# EasyEDA Pro project SoPi.epro, board PCB2
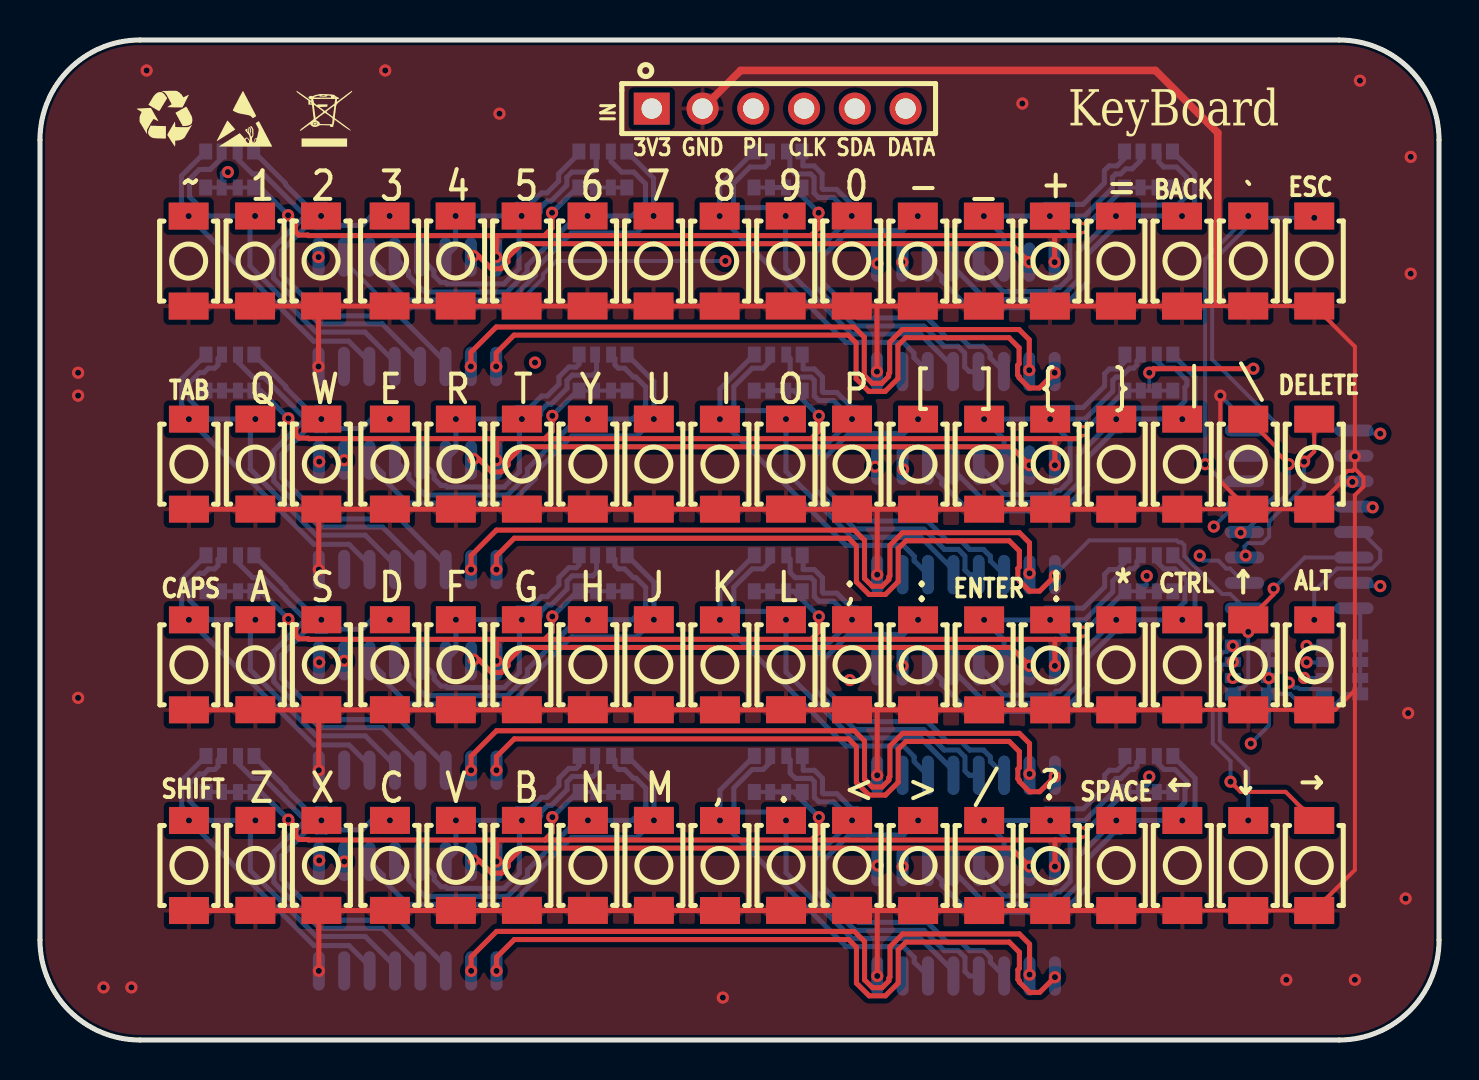
[diagram p4: board, top side]
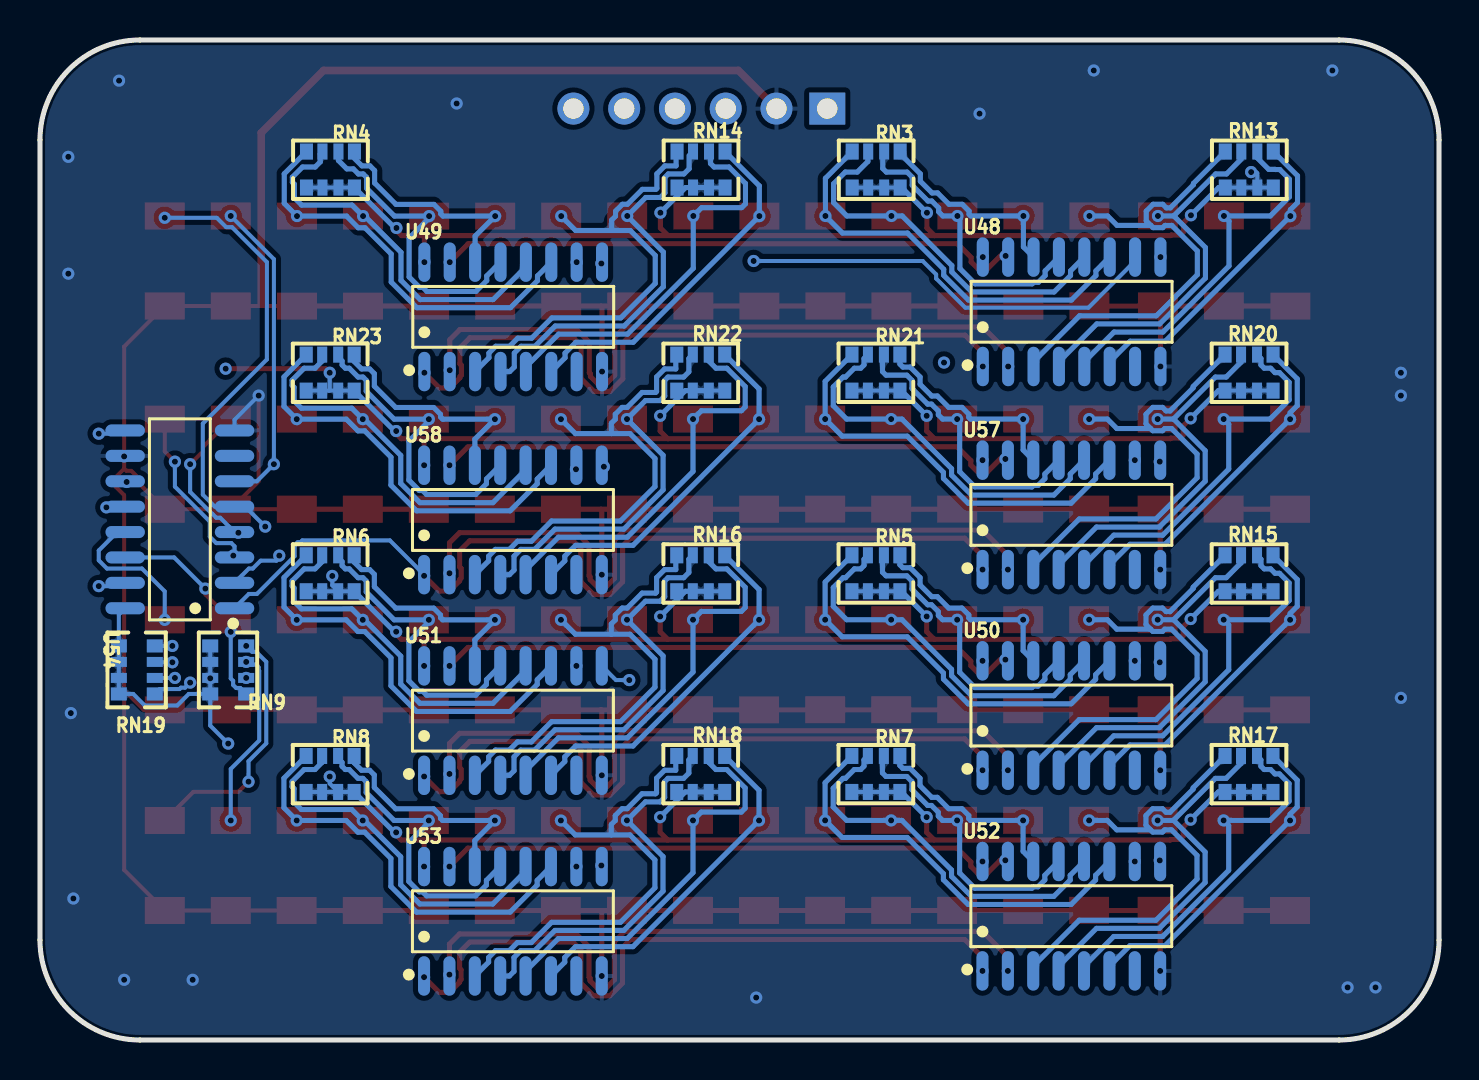
[diagram p5: board, bottom side, seen from below]

Outline 70 x 50 mm; copper layers: Top Layer, Inner1, Inner2, Bottom Layer. Coordinates in mm from the lower left corner of the outline.
Outline path: 0,45 0,5 arc(1.46,1.46) 5,0 65,0 arc(68.54,1.46) 70,5 70,45 arc(68.54,48.54) 65,50 5,50 arc(1.46,48.54) 0,45
Stack: Top Layer 0.035mm / Dielectric1 1.51mm FR4 er 4.5 / Inner1 0.035mm / Dielectric2 0.48mm PP er 4.5 / Inner2 0.035mm / Dielectric3 0.48mm PP er 4.5 / Bottom Layer 0.035mm

## Design rules (mm)
template: JLCPCB Capability(Two Layers Board)
spacing copperThickness1oz (default): track to track 0.102, other pairs 0.152 to 0.3
spacing copperThickness2oz: track to track 0.203, other pairs 0.152 to 0.3
track width copperThickness1oz (default): min 0.127, default 0.254, max 2.54
track width copperThickness2oz: min 0.203, default 0.254, max 2.54
differential pair differentialPair (default): width min 0.127, default 0.254, max 2.54; gap min 0.152, default 0.152
via viaSize (default): diameter min 0.5, default 0.61, max 10; hole min 0.3, default 0.305, max 6.3

## Placement (name value [footprint] x y rotation side)
IN  -  [HDR-TH_6P-P2.54-V-F]  36.96 46.57 0 top
RN3  10kΩ  [RES-ARRAY-SMD_0603-8P-L3.2-W1.6-BL]  28.16 43.52 0 bottom
RN4  10kΩ  [RES-ARRAY-SMD_0603-8P-L3.2-W1.6-BL]  55.47 43.52 0 bottom
RN5  10kΩ  [RES-ARRAY-SMD_0603-8P-L3.2-W1.6-BL]  28.17 23.34 0 bottom
RN6  10kΩ  [RES-ARRAY-SMD_0603-8P-L3.2-W1.6-BL]  55.48 23.34 0 bottom
RN7  10kΩ  [RES-ARRAY-SMD_0603-8P-L3.2-W1.6-BL]  28.18 13.3 0 bottom
RN8  10kΩ  [RES-ARRAY-SMD_0603-8P-L3.2-W1.6-BL]  55.48 13.3 0 bottom
RN9  10kΩ  [RES-ARRAY-SMD_0603-8P-L3.2-W1.6-BL]  60.58 18.5 90 bottom
RN13  10kΩ  [RES-ARRAY-SMD_0603-8P-L3.2-W1.6-BL]  9.49 43.52 0 bottom
RN14  10kΩ  [RES-ARRAY-SMD_0603-8P-L3.2-W1.6-BL]  36.92 43.52 0 bottom
RN15  10kΩ  [RES-ARRAY-SMD_0603-8P-L3.2-W1.6-BL]  9.51 23.34 0 bottom
RN16  10kΩ  [RES-ARRAY-SMD_0603-8P-L3.2-W1.6-BL]  36.94 23.34 0 bottom
RN17  10kΩ  [RES-ARRAY-SMD_0603-8P-L3.2-W1.6-BL]  9.51 13.3 0 bottom
RN18  10kΩ  [RES-ARRAY-SMD_0603-8P-L3.2-W1.6-BL]  36.94 13.3 0 bottom
RN19  10kΩ  [RES-ARRAY-SMD_0603-8P-L3.2-W1.6-BL]  65.15 18.5 90 bottom
RN20  10kΩ  [RES-ARRAY-SMD_0603-8P-L3.2-W1.6-BL]  9.51 33.37 0 bottom
RN21  10kΩ  [RES-ARRAY-SMD_0603-8P-L3.2-W1.6-BL]  28.17 33.37 0 bottom
RN22  10kΩ  [RES-ARRAY-SMD_0603-8P-L3.2-W1.6-BL]  36.94 33.37 0 bottom
RN23  10kΩ  [RES-ARRAY-SMD_0603-8P-L3.2-W1.6-BL]  55.48 33.37 0 bottom
SW90  -  [SW-SMD_L3.9-W2.9-P4.15-LS5.0]  7.44 38.95 90 top
SW91  -  [SW-SMD_L3.9-W2.9-P4.15-LS5.0]  10.76 38.95 90 top
SW92  -  [SW-SMD_L3.9-W2.9-P4.15-LS5.0]  14.06 38.95 90 top
SW93  -  [SW-SMD_L3.9-W2.9-P4.15-LS5.0]  17.49 38.95 90 top
SW94  -  [SW-SMD_L3.9-W2.9-P4.15-LS5.0]  20.8 38.95 90 top
SW95  -  [SW-SMD_L3.9-W2.9-P4.15-LS5.0]  24.1 38.95 90 top
SW96  -  [SW-SMD_L3.9-W2.9-P4.15-LS5.0]  27.4 38.95 90 top
SW97  -  [SW-SMD_L3.9-W2.9-P4.15-LS5.0]  30.7 38.95 90 top
SW98  -  [SW-SMD_L3.9-W2.9-P4.15-LS5.0]  34.01 38.95 90 top
SW99  -  [SW-SMD_L3.9-W2.9-P4.15-LS5.0]  37.31 38.95 90 top
SW100  -  [SW-SMD_L3.9-W2.9-P4.15-LS5.0]  40.62 38.95 90 top
SW101  -  [SW-SMD_L3.9-W2.9-P4.15-LS5.0]  43.92 38.95 90 top
SW102  -  [SW-SMD_L3.9-W2.9-P4.15-LS5.0]  47.23 38.95 90 top
SW103  -  [SW-SMD_L3.9-W2.9-P4.15-LS5.0]  50.53 38.95 90 top
SW104  -  [SW-SMD_L3.9-W2.9-P4.15-LS5.0]  53.83 38.95 90 top
SW105  -  [SW-SMD_L3.9-W2.9-P4.15-LS5.0]  57.14 38.95 90 top
SW106  -  [SW-SMD_L3.9-W2.9-P4.15-LS5.0]  7.45 18.76 90 top
SW107  -  [SW-SMD_L3.9-W2.9-P4.15-LS5.0]  10.78 18.76 90 top
SW108  -  [SW-SMD_L3.9-W2.9-P4.15-LS5.0]  14.08 18.76 90 top
SW109  -  [SW-SMD_L3.9-W2.9-P4.15-LS5.0]  17.51 18.76 90 top
SW110  -  [SW-SMD_L3.9-W2.9-P4.15-LS5.0]  20.81 18.76 90 top
SW111  -  [SW-SMD_L3.9-W2.9-P4.15-LS5.0]  24.11 18.76 90 top
SW112  -  [SW-SMD_L3.9-W2.9-P4.15-LS5.0]  27.41 18.76 90 top
SW113  -  [SW-SMD_L3.9-W2.9-P4.15-LS5.0]  30.71 18.76 90 top
SW114  -  [SW-SMD_L3.9-W2.9-P4.15-LS5.0]  34.02 18.76 90 top
SW115  -  [SW-SMD_L3.9-W2.9-P4.15-LS5.0]  37.33 18.76 90 top
SW116  -  [SW-SMD_L3.9-W2.9-P4.15-LS5.0]  40.63 18.76 90 top
SW117  -  [SW-SMD_L3.9-W2.9-P4.15-LS5.0]  43.93 18.76 90 top
SW118  -  [SW-SMD_L3.9-W2.9-P4.15-LS5.0]  47.24 18.76 90 top
SW119  -  [SW-SMD_L3.9-W2.9-P4.15-LS5.0]  50.54 18.76 90 top
SW120  -  [SW-SMD_L3.9-W2.9-P4.15-LS5.0]  53.85 18.76 90 top
SW121  -  [SW-SMD_L3.9-W2.9-P4.15-LS5.0]  57.15 18.76 90 top
SW122  -  [SW-SMD_L3.9-W2.9-P4.15-LS5.0]  7.45 8.73 90 top
SW123  -  [SW-SMD_L3.9-W2.9-P4.15-LS5.0]  10.78 8.73 90 top
SW124  -  [SW-SMD_L3.9-W2.9-P4.15-LS5.0]  14.08 8.73 90 top
SW125  -  [SW-SMD_L3.9-W2.9-P4.15-LS5.0]  17.51 8.73 90 top
SW126  -  [SW-SMD_L3.9-W2.9-P4.15-LS5.0]  20.81 8.73 90 top
SW127  -  [SW-SMD_L3.9-W2.9-P4.15-LS5.0]  24.11 8.73 90 top
SW128  -  [SW-SMD_L3.9-W2.9-P4.15-LS5.0]  27.42 8.73 90 top
SW129  -  [SW-SMD_L3.9-W2.9-P4.15-LS5.0]  30.72 8.73 90 top
SW130  -  [SW-SMD_L3.9-W2.9-P4.15-LS5.0]  34.02 8.73 90 top
SW131  -  [SW-SMD_L3.9-W2.9-P4.15-LS5.0]  37.33 8.73 90 top
SW132  -  [SW-SMD_L3.9-W2.9-P4.15-LS5.0]  40.63 8.73 90 top
SW133  -  [SW-SMD_L3.9-W2.9-P4.15-LS5.0]  43.94 8.73 90 top
SW134  -  [SW-SMD_L3.9-W2.9-P4.15-LS5.0]  47.24 8.73 90 top
SW135  -  [SW-SMD_L3.9-W2.9-P4.15-LS5.0]  50.55 8.73 90 top
SW136  -  [SW-SMD_L3.9-W2.9-P4.15-LS5.0]  53.85 8.73 90 top
SW137  -  [SW-SMD_L3.9-W2.9-P4.15-LS5.0]  57.16 8.73 90 top
SW138  -  [SW-SMD_L3.9-W2.9-P4.15-LS5.0]  60.45 38.95 90 top
SW139  -  [SW-SMD_L3.9-W2.9-P4.15-LS5.0]  63.76 38.95 90 top
SW140  -  [SW-SMD_L3.9-W2.9-P4.15-LS5.0]  60.45 28.79 90 top
SW141  -  [SW-SMD_L3.9-W2.9-P4.15-LS5.0]  63.76 28.79 90 top
SW142  -  [SW-SMD_L3.9-W2.9-P4.15-LS5.0]  60.45 18.76 90 top
SW143  -  [SW-SMD_L3.9-W2.9-P4.15-LS5.0]  63.76 18.76 90 top
SW144  -  [SW-SMD_L3.9-W2.9-P4.15-LS5.0]  60.45 8.73 90 top
SW145  -  [SW-SMD_L3.9-W2.9-P4.15-LS5.0]  63.76 8.73 90 top
SW146  -  [SW-SMD_L3.9-W2.9-P4.15-LS5.0]  7.45 28.79 90 top
SW147  -  [SW-SMD_L3.9-W2.9-P4.15-LS5.0]  10.78 28.8 90 top
SW148  -  [SW-SMD_L3.9-W2.9-P4.15-LS5.0]  14.08 28.8 90 top
SW149  -  [SW-SMD_L3.9-W2.9-P4.15-LS5.0]  17.51 28.8 90 top
SW150  -  [SW-SMD_L3.9-W2.9-P4.15-LS5.0]  20.81 28.8 90 top
SW151  -  [SW-SMD_L3.9-W2.9-P4.15-LS5.0]  24.11 28.8 90 top
SW152  -  [SW-SMD_L3.9-W2.9-P4.15-LS5.0]  27.41 28.8 90 top
SW153  -  [SW-SMD_L3.9-W2.9-P4.15-LS5.0]  30.71 28.8 90 top
SW154  -  [SW-SMD_L3.9-W2.9-P4.15-LS5.0]  34.02 28.79 90 top
SW155  -  [SW-SMD_L3.9-W2.9-P4.15-LS5.0]  37.33 28.8 90 top
SW156  -  [SW-SMD_L3.9-W2.9-P4.15-LS5.0]  40.63 28.8 90 top
SW157  -  [SW-SMD_L3.9-W2.9-P4.15-LS5.0]  43.93 28.79 90 top
SW158  -  [SW-SMD_L3.9-W2.9-P4.15-LS5.0]  47.24 28.79 90 top
SW159  -  [SW-SMD_L3.9-W2.9-P4.15-LS5.0]  50.54 28.79 90 top
SW160  -  [SW-SMD_L3.9-W2.9-P4.15-LS5.0]  53.85 28.79 90 top
SW161  -  [SW-SMD_L3.9-W2.9-P4.15-LS5.0]  57.15 28.79 90 top
U48  -  [SOIC-16_L9.9-W3.9-P1.27-LS6.0-BL]  18.38 36.41 180 bottom
U49  -  [SOIC-16_L9.9-W3.9-P1.27-LS6.0-BL]  46.32 36.16 180 bottom
U50  -  [SOIC-16_L9.9-W3.9-P1.27-LS6.0-BL]  18.4 16.22 180 bottom
U51  -  [SOIC-16_L9.9-W3.9-P1.27-LS6.0-BL]  46.34 15.97 180 bottom
U52  -  [SOIC-16_L9.9-W3.9-P1.27-LS6.0-BL]  18.4 6.19 180 bottom
U53  -  [SOIC-16_L9.9-W3.9-P1.27-LS6.0-BL]  46.34 5.94 180 bottom
U54  -  [SOIC-16_L9.9-W3.9-P1.27-LS6.0-BL]  63 26.03 90 bottom
U57  -  [SOIC-16_L9.9-W3.9-P1.27-LS6.0-BL]  18.4 26.26 180 bottom
U58  -  [SOIC-16_L9.9-W3.9-P1.27-LS6.0-BL]  46.34 26 180 bottom

## Footprints (pads in the part's own frame, mm; a bottom-side part is the same pattern mirrored in y, then rotated)
HDR-TH_6P-P2.54-V-F
  rect 1.8x1.6 hole 1.02: 1(-6.35,0)
  round 1.6 hole 1.02: 2(-3.81,0) 3(-1.27,0) 4(1.27,0) 5(3.81,0) 6(6.35,0)
RES-ARRAY-SMD_0603-8P-L3.2-W1.6-BL
  rect 0.65x0.8 smd: 1(-1.2,-0.9) 4(1.2,-0.9) 5(1.2,0.9) 8(-1.2,0.9)
  rect 0.5x0.8 smd: 2(-0.4,-0.9) 3(0.4,-0.9) 6(0.4,0.9) 7(-0.4,0.9)
SOIC-16_L9.9-W3.9-P1.27-LS6.0-BL
  oval 0.602x1.971 smd: 1(-4.445,-2.736) 2(-3.175,-2.736) 3(-1.905,-2.736) 4(-0.635,-2.736) 5(0.635,-2.736) 6(1.905,-2.736) 7(3.175,-2.736) 8(4.445,-2.736) 9(4.445,2.736) 10(3.175,2.736) 11(1.905,2.736) 12(0.635,2.736) 13(-0.635,2.736) 14(-1.905,2.736) 15(-3.175,2.736) 16(-4.445,2.736)
SW-SMD_L3.9-W2.9-P4.15-LS5.0
  rect 1.351x1.999 smd: 1(-2.251,0) 2(2.251,0)

## Nets
As in the schematic.

Pads without a net: U48 7; U49 7; U50 7; U51 7; U52 7; U53 7; U54 7; U57 7; U58 7

## Via types
v1: diameter 0.61, hole 0.305, Top Layer to Bottom Layer, 188 vias

## Routing (per net, layer and track width the routed paths; a pad name or vN(x,y) marks a point on that pad's centre or on a via; arc(x,y) is an arc through that point)
+3V3: length 318.2
  Top Layer w0.254: 22.81,10 22.84,9.97 v1(22.84,8.93) ; 22.81,10 13.44,10 13.42,10.03 12.97,10.03 12.8,10.19 12.8,10.64 v1(12.43,11.02) ; 22.81,10 25.26,10 ; 50.8,40.22 50.77,40.18 v1(50.77,38.89) ; 50.8,40.22 38.58,40.22 ; 50.8,40.22 51.91,40.22 52.16,40.48 v1(52.16,40.6) ; v1(52.18,30.45) 52.18,30.32 51.92,30.07 50.82,30.07 ; 25.25,30.07 25.63,30.45 v1(25.63,31.21) ; 25.25,30.07 22.81,30.07 ; 25.25,30.07 38.59,30.07 ; 22.81,30.07 22.84,30.04 v1(22.84,28.99) ; 22.81,30.07 13.44,30.07 13.42,30.09 12.96,30.09 12.8,30.26 12.8,30.71 v1(12.43,31.08) ; 50.82,30.07 50.78,30.03 v1(50.78,28.74) ; 50.82,30.07 38.59,30.07 ; 50.82,20.03 50.78,20 v1(50.78,18.71) ; 50.82,20.03 38.59,20.03 ; 50.82,20.03 51.92,20.03 52.18,20.29 v1(52.18,20.41) ; 38.59,10 38.97,10.38 v1(38.97,11.14) ; 38.59,10 50.82,10 ; 38.59,10 25.26,10 ; 50.82,10 51.93,10 52.18,10.25 v1(52.18,10.38) ; 50.82,10 50.78,9.96 v1(50.78,8.67) ; v1(38.97,31.21) 38.97,30.45 38.59,30.07 ; 22.81,20.03 25.25,20.03 ; 22.81,20.03 22.84,20 v1(22.84,18.96) ; 22.81,20.03 13.44,20.03 13.42,20.06 12.96,20.06 12.8,20.22 12.8,20.68 v1(12.43,21.05) ; 25.25,20.03 25.63,20.41 v1(25.63,21.18) ; 25.25,20.03 38.59,20.03 ; v1(38.96,41.36) 38.96,40.6 38.58,40.22 ; 38.58,40.22 25.24,40.22 ; 25.24,40.22 25.62,40.6 v1(25.62,41.36) ; 25.24,40.22 22.8,40.22 ; v1(12.41,41.24) 12.79,40.86 12.79,40.41 12.95,40.25 13.4,40.25 13.43,40.22 22.8,40.22 ; v1(38.97,21.18) 38.97,20.41 38.59,20.03 ; 22.8,40.22 22.83,40.19 v1(22.83,39.15) ; v1(55.5,33.36) 55.7,33.56 v1(60.71,33.56) ; 25.26,10 25.64,10.38 v1(25.64,11.14)
  Inner1 w0.2: v1(9.4,43.4) 9.07,43.73 ; v1(55.5,33.36) 50.77,38.1 v1(50.77,38.89) ; v1(55.5,13.17) 58.93,13.17 v1(60.58,14.82) 58.8,16.6 58.8,20.28 55.88,23.2 v1(55.37,23.2) 50.78,27.8 v1(50.78,28.74)
  Inner1 w0.381: v1(25.62,41.36) 25.62,41.84 30.36,46.57 IN.1
  Bottom Layer w0.2: RN15.8 RN15.7 RN15.6 RN15.5 ; RN4.5 RN4.6 RN4.7 RN4.8 ; RN13.7 RN13.6 RN13.5 ; RN13.7 9.09,43.34 9.15,43.4 v1(9.4,43.4) ; RN13.7 RN13.8 ; RN20.8 RN20.7 RN20.6 RN20.5 ; RN6.5 RN6.6 RN6.7 ; RN8.8 RN8.7 ; RN8.7 55.5,12.82 v1(55.5,13.17) ; RN8.7 RN8.6 RN8.5 ; RN17.8 RN17.7 RN17.6 RN17.5 ; v1(55.5,33.36) 55.5,32.5 55.53,32.47 ; RN16.8 RN16.7 ; RN18.8 RN18.7 ; RN23.5 RN23.6 55.53,32.47 ; RN9.8 RN9.6 RN9.5 ; RN9.8 62.55,17.3 63.13,16.73 64.76,16.73 65.34,17.3 RN19.8 RN19.6 RN19.5 66.05,21.27 U54.16 ; RN9.8 61.48,15.72 v1(60.58,14.82) ; RN6.8 RN6.7 ; RN6.7 55.37,22.73 v1(55.37,23.2) ; 55.53,32.47 RN23.7 RN23.8 ; RN14.8 RN14.7 ; RN21.5 RN21.6 RN21.7 RN21.8 ; RN3.8 RN3.7 RN3.6 RN3.5 ; RN7.5 RN7.6 RN7.7 RN7.8 ; RN5.8 RN5.7 RN5.6 RN5.5 ; RN22.8 RN22.7
  Bottom Layer w0.254: v1(25.63,31.21) 26.89,32.47 RN21.8 ; RN23.8 52.26,30.45 v1(52.18,30.45) ; v1(38.97,21.18) 37.71,22.44 RN16.6 RN16.7 ; RN20.5 11.04,32.47 v1(12.43,31.08) ; v1(12.43,11.02) 11.04,12.4 RN17.5 ; RN4.8 52.25,40.6 v1(52.16,40.6) ; v1(12.41,41.24) 11.03,42.62 RN13.5 ; RN6.8 52.26,20.41 v1(52.18,20.41) ; v1(25.64,11.14) 26.9,12.4 RN7.8 ; v1(38.97,11.14) 37.71,12.4 RN18.6 RN18.7 ; RN15.5 11.04,22.44 v1(12.43,21.05) ; v1(38.96,41.36) 37.7,42.62 RN14.6 RN14.7 ; RN5.8 26.89,22.44 v1(25.63,21.18) ; v1(52.18,10.38) 52.26,10.38 RN8.8 ; RN22.7 RN22.6 37.71,32.47 v1(38.97,31.21) ; RN3.8 26.88,42.62 v1(25.62,41.36)
  vias: v1(61.48,18.09)
GND: length 333.8
  Top Layer w0.2: 65.79,28.57 65.79,28.56 66.22,28.13 66.22,27.67 65.79,27.24 65.79,17.49 ; 65.79,28.57 65.68,28.46 65.43,28.46 65.11,28.13 65.11,27.89 SW141.1 SW140.1 ; 65.79,28.57 v1(65.79,29.18) 65.79,34.67 SW139.1 63.75,36.7 SW105.1 ; 7.16,6.19 SW122.1 ; v1(59.06,32.22) 59.06,27.94 SW140.1 ; SW140.1 SW161.1 ; SW121.1 SW142.1 SW143.1 64.81,16.51 65.79,17.49 ; 65.79,17.49 65.79,8.51 SW145.1 SW144.1 SW137.1
  Top Layer w0.254: 41.93,36.7 SW98.1 14.06,36.7 ; 41.93,36.7 SW101.1 SW102.1 SW103.1 SW104.1 SW105.1 ; 41.93,36.7 41.88,36.64 v1(41.88,33.42) ; v1(41.89,3.2) 41.89,6.42 41.95,6.47 ; v1(13.95,3.45) 13.95,6.35 14.08,6.47 ; 14.06,36.7 SW92.1 ; 14.06,36.7 13.94,36.57 v1(13.94,33.68) ; 14.06,36.7 SW90.1 ; v1(13.95,23.52) 13.95,26.42 14.07,26.54 ; 41.95,26.54 SW154.1 14.07,26.54 ; 41.95,26.54 41.89,26.49 v1(41.89,23.27) ; 41.95,26.54 SW157.1 SW158.1 SW159.1 SW160.1 SW161.1 ; 14.08,6.47 SW130.1 41.95,6.47 ; 14.08,6.47 SW122.1 ; 14.08,6.47 SW124.1 ; SW137.1 SW136.1 SW135.1 SW134.1 SW133.1 41.95,6.47 ; 14.07,16.51 SW114.1 41.95,16.51 ; 14.07,16.51 SW106.1 ; 14.07,16.51 SW108.1 ; 14.07,16.51 13.95,16.39 v1(13.95,13.49) ; SW121.1 SW120.1 SW119.1 SW118.1 SW117.1 41.95,16.51 ; v1(41.89,13.23) 41.89,16.45 41.95,16.51 ; 14.07,26.54 SW148.1 ; 14.07,26.54 SW146.1
  Top Layer w0.381: IN.2 35.05,48.48 55.81,48.48 58.93,45.36 58.93,36.79
  Bottom Layer w0.2: v1(59.06,32.22) 60.27,31.01 U54.8
  vias: v1(1.91,33.36) v1(1.91,32.22) v1(1.91,17.11) v1(3.18,2.63) v1(4.58,2.63) v1(5.34,48.48) v1(17.27,48.48) v1(22.99,46.32) v1(34.17,2.12) v1(49.15,46.83) v1(62.36,3.01) v1(65.79,3.01) v1(66.04,47.97) v1(68.33,7.07) v1(68.46,16.35) v1(68.58,44.16) v1(68.58,38.32)
PE3: length 45.3
  Inner1 w0.254: v1(13.97,28.92) 16.13,31.08 16.13,43.52 20.7,48.1 41.79,48.1 IN.6
  Bottom Layer w0.2: U57.9 13.95,28.94 v1(13.97,28.92)
PE9: length 205.8
  Top Layer w0.254: v1(50.78,3.14) 50.02,2.38 49.51,2.38 49.01,2.89 49.01,2.95 48.93,3.03 48.93,3.51 49.01,3.59 49.01,4.39 48.5,4.9 43.33,4.9 42.94,4.51 42.94,2.85 42.3,2.21 41.48,2.21 40.85,2.84 40.85,4.63 40.46,5.02 23.73,5.02 22.84,4.13 v1(22.84,3.45) ; v1(22.84,13.49) 22.84,14.17 23.73,15.06 40.46,15.06 40.85,14.67 40.85,12.87 41.48,12.24 42.3,12.24 42.94,12.88 42.94,14.54 43.33,14.93 48.49,14.93 49,14.42 49,13.62 48.93,13.54 48.93,13.06 49,12.98 49,12.92 49.51,12.41 50.02,12.41 v1(50.78,13.18) ; v1(50.78,23.21) 50.02,22.45 49.51,22.45 49,22.95 49,23.02 48.93,23.09 48.93,23.58 49,23.65 49,24.45 48.49,24.96 43.33,24.96 42.94,24.57 42.94,22.92 42.3,22.28 41.48,22.28 40.85,22.91 40.85,24.7 40.46,25.09 23.73,25.09 22.84,24.2 v1(22.84,23.52) ; v1(50.77,33.36) 50.01,32.6 49.5,32.6 48.99,33.11 48.99,33.17 48.91,33.25 48.91,33.73 48.99,33.81 48.99,34.61 48.48,35.12 43.32,35.12 42.93,34.73 42.93,33.07 42.29,32.43 41.47,32.43 40.84,33.06 40.84,34.85 40.45,35.24 23.72,35.24 22.83,34.35 v1(22.83,33.68)
  Inner1 w0.2: v1(22.83,33.68) 22.83,30.22 23.37,29.68 23.37,29.25 23.4,29.22 23.4,28.76 23.37,28.73 23.37,24.05 v1(22.84,23.52) 23.75,22.61 23.75,21.44 23.55,21.24 23.55,20.78 23.75,20.58 23.75,14.4 v1(22.84,13.49) 23.5,12.83 23.5,4.11 v1(22.84,3.45)
  Inner1 w0.254: v1(22.83,33.68) 28.99,39.84 30.99,39.84 32.31,41.16 32.31,42.43 35.69,45.81 IN.3
  Bottom Layer w0.2: U58.1 52.49,24.98 56.87,24.98 56.96,24.89 57.11,24.89 57.26,24.74 57.26,24.19 59.14,22.3 59.55,22.3 U54.1
PE10: length 203.2
  Top Layer w0.254: v1(21.57,13.49) 21.57,14.19 22.84,15.46 40.75,15.46 41.26,14.95 41.26,13.04 41.65,12.65 42.13,12.65 42.47,12.99 42.47,13.12 42.53,13.18 42.53,14.7 43.16,15.33 49,15.33 49.51,14.83 v1(49.51,13.3) ; v1(21.56,33.68) 21.56,34.38 22.83,35.65 40.73,35.65 41.24,35.14 41.24,33.23 41.64,32.84 42.12,32.84 42.46,33.18 42.46,33.31 42.51,33.36 42.51,34.89 43.15,35.52 48.99,35.52 49.5,35.01 v1(49.5,33.49) ; v1(21.57,3.45) 21.57,4.16 22.84,5.43 40.75,5.43 41.26,4.92 41.26,3.01 41.65,2.62 42.14,2.62 42.48,2.96 42.48,3.09 42.53,3.14 42.53,4.67 43.16,5.3 49.01,5.3 49.51,4.79 v1(49.51,3.27) ; v1(49.51,23.34) 49.51,24.86 49,25.37 43.16,25.37 42.53,24.73 42.53,23.21 42.47,23.16 42.47,23.03 42.13,22.68 41.65,22.68 41.26,23.08 41.26,24.99 40.75,25.49 22.84,25.49 21.57,24.22 v1(21.57,23.52)
  Inner1 w0.2: v1(21.56,33.68) 22.25,32.98 22.25,28.82 22.23,28.79 ; 22.23,14.15 v1(21.57,13.49) ; 22.23,14.15 22.23,9.24 22.26,9.22 22.26,8.75 22.23,8.73 22.23,4.11 v1(21.57,3.45) ; 22.23,14.15 22.23,18.76 22.25,18.79 22.25,19.25 22.23,19.27 22.23,22.86 v1(21.57,23.52) 22.23,24.18 22.23,28.79
  Inner1 w0.254: IN.4 38.23,45.43 49.5,34.16 v1(49.5,33.49)
  Inner2 w0.2: v1(58.03,24.22) 50.39,24.22 v1(49.51,23.34)
  Bottom Layer w0.2: U54.2 59.55,23.57 59.35,23.57 58.96,23.97 58.17,23.97 58.17,24.08 v1(58.03,24.22)
  Bottom Layer w0.254: v1(49.51,23.34) U58.2 ; v1(49.51,3.27) 49.51,3.2 ; v1(49.5,33.49) U49.2 ; v1(49.51,13.3) U51.2
PE12: length 184.7
  Top Layer w0.254: v1(21.7,19.02) 21.96,19.02 22.6,18.38 23.08,18.38 23.42,18.72 23.42,18.94 24.11,19.63 48.59,19.63 v1(49.51,18.71) ; v1(21.7,29.05) 21.96,29.05 22.6,28.41 23.08,28.41 23.42,28.75 23.42,28.97 24.11,29.66 48.59,29.66 v1(49.51,28.74) ; v1(49.51,8.67) 48.59,9.59 24.11,9.59 23.43,8.91 23.43,8.68 23.08,8.34 22.6,8.34 21.96,8.98 v1(21.7,8.98) ; v1(21.68,39.21) 21.94,39.21 22.59,38.56 23.07,38.56 23.41,38.9 23.41,39.13 24.1,39.82 48.58,39.82 v1(49.5,38.89)
  Inner1 w0.2: v1(21.68,39.21) 21.68,34.59 21,33.91 21,33.44 21.68,32.76 21.68,29.06 v1(21.7,29.05) 21.7,24.44 21.01,23.75 21.01,23.29 21.34,22.96 21.63,22.96 21.7,22.9 v1(21.7,19.02) 21.7,14.4 21.01,13.72 21.01,13.26 21.7,12.57 21.7,8.99 v1(21.7,8.98)
  Inner1 w0.254: v1(49.5,38.89) 48.45,38.89 IN.5
  Inner2 w0.2: v1(49.51,18.71) 49.99,18.71 50.55,18.15 51.01,18.15 51.57,18.71 57.97,18.71 59.31,17.36 62.21,17.36 62.26,17.31 62.72,17.31 62.77,17.36 64.14,17.36 64.28,17.5 64.28,19.92 v1(67.06,22.7)
  Bottom Layer w0.2: v1(67.06,22.7) 65.9,22.7 U54.15
  Bottom Layer w0.254: U57.15 21.63,29.05 v1(21.7,29.05) ; v1(21.7,8.98) 21.63,8.98 21.57,8.93 ; U48.15 21.62,39.21 v1(21.68,39.21) ; U50.15 21.63,19.02 v1(21.7,19.02)
$1N34101: length 16.2
  Bottom Layer w0.254: RN15.1 7.09,23.02 7.09,21.68 7.45,21.33 v1(7.45,21.01) 13.71,14.75 ; 13.71,14.75 15.46,14.75 16.49,13.72 U50.6
$1N34102: length 19
  Bottom Layer w0.254: U50.5 17.76,13.72 16.27,15.21 13.83,15.21 10.52,18.51 10.52,20.76 v1(10.78,21.01) 8.46,21.01 7.5,21.97 7.5,22.85 7.98,23.34 8.21,23.34 8.43,23.56 8.75,23.56 8.91,23.72 8.91,24.04 RN15.2
$1N34103: length 18.8
  Bottom Layer w0.254: U50.4 19.03,13.72 17.14,15.62 13.99,15.62 11.7,17.91 11.7,19.43 13.28,21.01 ; 13.28,21.01 v1(14.08,21.01) ; 13.28,21.01 13.28,21.02 11.19,23.11 10.65,23.11 9.91,23.86 RN15.3
$1N34104: length 23.8
  Bottom Layer w0.254: 14.43,20.54 14.32,20.43 13.84,20.43 13.72,20.54 13.38,20.54 12.11,19.27 12.11,18.08 14.16,16.02 18,16.02 20.3,13.72 U50.3 ; 14.43,20.54 14.66,20.77 14.66,21.26 14.32,21.6 13.84,21.6 13.66,21.42 13.46,21.42 12.3,22.58 12.3,22.64 RN15.4 ; 14.43,20.54 16.12,20.54 16.59,21.01 v1(17.51,21.01)
$1N34105: length 20.9
  Bottom Layer w0.254: U50.11 17.18,18.27 17.18,18.03 18.41,16.81 23.56,16.81 24.8,18.05 24.8,18.35 26.61,20.16 29.86,20.16 v1(30.71,21.01) 30.71,22.9 RN5.4
$1N34106: length 10.4
  Bottom Layer w0.254: RN5.1 26.97,23.76 26.83,23.61 26.46,23.61 25.96,23.12 25.96,22.75 25.38,22.17 25.1,22.17 24.53,21.6 23.87,21.6 23.53,21.26 23.53,21.1 23.44,21.01 v1(20.81,21.01) 20.81,19.47 U50.14
$1N34107: length 14.6
  Bottom Layer w0.254: RN5.2 27.85,24.16 27.85,23.39 27.67,23.21 26.63,23.21 26.37,22.95 26.37,22.55 25.58,21.76 25.39,21.76 25.05,21.42 25.05,21.23 24.84,21.01 v1(24.11,21.01) 23.98,20.89 23.98,18.38 23.22,17.62 20.37,17.62 20.3,17.69 20.06,17.69 19.72,18.03 19.72,18.27 U50.13
$1N34108: length 19
  Bottom Layer w0.254: RN5.3 28.77,24.04 28.77,23.72 28.93,23.56 29.25,23.56 29.7,23.11 29.81,23.11 30.31,22.62 30.31,21.68 29.64,21.01 v1(27.41,21.01) 26.87,21.01 24.39,18.53 24.39,18.21 23.39,17.21 19.27,17.21 18.45,18.03 18.45,18.27 U50.12
$1N34113: length 17.7
  Bottom Layer w0.254: U53.6 43.74,3.89 43.74,4.13 43.2,4.67 40.33,4.67 v1(34.02,10.98) 34.02,12.49 RN18.1
$1N34114: length 19.8
  Bottom Layer w0.254: RN18.2 36.54,13.88 36.18,13.52 35.64,13.52 34.72,12.6 34.72,11.59 34.91,11.4 36.91,11.4 v1(37.33,10.98) 37.33,8.36 40.62,5.07 44.07,5.07 45.7,3.44 U53.5
$1N34115: length 20.1
  Bottom Layer w0.254: RN18.3 37.54,14.01 37.54,13.34 37.8,13.08 38.58,13.08 38.74,12.92 38.74,12.13 38.97,11.91 39.71,11.91 v1(40.63,10.98) 38.83,9.17 38.83,7.44 40.79,5.48 44.23,5.48 45.25,4.47 45.94,4.47 46.28,4.13 46.28,3.43 46.51,3.2 U53.4
$1N34116: length 24.1
  Bottom Layer w0.254: 41.41,10.25 43.22,10.25 v1(43.94,10.98) ; 41.41,10.25 41.41,10.77 41.22,10.97 41.22,11.22 40.87,11.56 40.62,11.56 39.88,12.31 39.2,12.31 39.15,12.36 39.15,13.09 38.75,13.49 38.19,13.49 38.19,14.15 RN18.4 ; 41.41,10.25 40.48,10.25 39.23,9.01 39.23,7.61 40.96,5.88 44.4,5.88 45.42,4.87 46.11,4.87 46.52,4.47 47.21,4.47 47.55,4.13 47.55,3.89 U53.3
$1N34117: length 20.5
  Bottom Layer w0.254: 44.43,8.67 45.12,7.98 45.12,7.75 46.48,6.39 51.16,6.39 52.44,7.68 52.44,9.08 53.75,10.39 54.09,10.39 54.68,10.98 v1(57.16,10.98) 57.79,11.61 57.79,13.09 56.68,14.2
$1N34118: length 11.7
  Bottom Layer w0.254: RN8.1 54.28,13.86 53.91,13.49 53.51,13.49 53.27,13.25 53.27,12.63 52.2,11.56 50.3,11.56 49.96,11.22 49.96,11.08 49.85,10.98 v1(47.24,10.98) 48.24,9.97 48.24,8.67
$1N34119: length 15.5
  Bottom Layer w0.254: 46.97,8.67 47.66,7.98 47.66,7.75 48.2,7.21 50.66,7.21 50.86,7.41 51.02,7.41 51.55,7.93 51.55,9.87 50.55,10.87 v1(50.55,10.98) 52.28,10.98 53.68,12.37 53.68,12.92 53.84,13.08 54.08,13.08 54.53,13.52 54.72,13.52 54.89,13.69 54.89,13.88 55.08,14.08 RN8.2
$1N34120: length 18.6
  Bottom Layer w0.254: 53.76,10.98 51.95,9.16 51.95,7.76 50.99,6.8 47.34,6.8 45.7,8.44 45.7,8.67 ; RN8.3 55.88,13.88 56.24,13.52 56.78,13.52 57.39,12.92 57.39,12.67 57.29,12.57 57.29,11.89 56.92,11.52 54.4,11.52 v1(53.85,10.98) ; 53.85,11.1 53.86,11.11
$1N34124: length 30.9
  Inner1 w0.2: v1(58.3,28.79) 57.79,28.28 57.79,25.36 59.07,24.08 59.07,23.7 59.81,22.96 60.05,22.96 61.35,21.66 61.37,21.66 62.04,21 62.04,18.32 v1(62.49,17.87)
  Bottom Layer w0.2: v1(60.45,41.2) 58.3,39.04 v1(58.3,28.79) 59.15,27.94 U54.6 ; v1(62.49,17.87) 62.74,17.62 62.95,17.62 63.02,17.55 64.01,17.55 RN19.1
$1N34125: length 33.7
  Top Layer w0.2: v1(63.76,41.11) SW139.2
  Inner1 w0.2: v1(63.25,18.1) 62.39,18.96 62.39,21.3 61.68,22.01 61.49,22.01 61.17,22.34 61.17,22.52 60.38,23.31 59.95,23.31 59.42,23.84 59.42,24.98 v1(58.73,25.67)
  Bottom Layer w0.2: 64.25,18.1 v1(63.25,18.1) ; v1(58.73,25.67) 59.73,26.67 U54.5 61.25,26.67 61.85,27.27 61.85,30.82 58.65,34.03 58.65,38.9 60.4,40.64 60.69,40.64 61.15,41.11 v1(63.76,41.11)
$1N34126: length 17.8
  Top Layer w0.2: SW140.2 61.85,29.64 61.85,29.43 v1(62.49,28.79)
  Inner1 w0.2: v1(63.38,18.89) 62.74,19.52 62.74,22.58 61.45,23.87 60.76,23.87 60.56,23.66 60.1,23.66 59.77,23.99 59.77,25.06 v1(60.07,25.36)
  Bottom Layer w0.2: v1(62.49,28.79) 62.49,27.4 61.4,26.32 61.38,26.32 61.18,26.11 60.98,26.11 U54.4 60.11,25.4 v1(60.07,25.36) ; v1(63.38,18.89) 64.23,18.89 RN19.3
$1N34127: length 16.3
  Top Layer w0.2: SW141.2 63.76,29.43 v1(63.25,28.92)
  Inner1 w0.2: v1(63.38,19.7) 63.38,20.6 63.2,20.78 63.2,21.24 63.38,21.42 63.38,22.44 61.6,24.22 v1(60.33,24.22)
  Bottom Layer w0.2: RN19.4 v1(63.38,19.7) ; U54.3 60.27,24.69 60.42,24.84 61.18,24.84 61.5,25.17 61.5,25.92 63.25,27.67 v1(63.25,28.92)
$1N34128: length 10.9
  Top Layer w0.2: v1(61.73,22.57) 61.73,22.28 SW142.2 v1(60.45,20.41)
  Bottom Layer w0.2: U54.14 63.28,24.13 v1(61.73,22.57) ; v1(60.45,20.41) 60.45,18.08 60.33,17.96 60.33,17.75 60.19,17.6 59.98,17.6 RN9.1
$1N34135: length 19.1
  Bottom Layer w0.254: RN3.3 28.58,44.41 28.58,43.92 29.11,43.4 29.71,43.4 30.3,42.81 30.3,41.87 29.62,41.2 v1(27.4,41.2) 26.86,41.2 24.38,38.72 24.38,38.4 23.38,37.4 19.26,37.4 18.44,38.22 18.44,38.46 U48.12
$1N34136: length 14.5
  Bottom Layer w0.254: 27.83,44.35 27.83,43.58 27.65,43.4 26.61,43.4 26.36,43.14 26.36,42.74 25.57,41.95 25.38,41.95 25.04,41.61 25.04,41.42 24.82,41.2 v1(24.1,41.2) 23.97,41.07 23.97,38.57 23.21,37.81 20.36,37.81 20.28,37.88 20.05,37.88 19.71,38.22 19.71,38.46 U48.13
$1N34137: length 10.1
  Bottom Layer w0.254: U48.14 20.8,39.65 v1(20.8,41.2) 23.43,41.2 23.51,41.29 23.51,41.44 23.86,41.79 24.52,41.79 25.09,42.35 25.37,42.35 25.95,42.94 25.95,43.31 26.96,44.32 RN3.1
$1N34138: length 20.9
  Bottom Layer w0.254: U48.11 17.17,38.46 17.17,38.22 18.39,37 23.55,37 24.78,38.23 24.78,38.54 26.59,40.35 29.85,40.35 v1(30.7,41.2) 30.7,43.08 RN3.4
$1N34139: length 23.8
  Bottom Layer w0.254: U48.3 20.29,33.91 17.99,36.21 14.15,36.21 12.09,38.27 12.09,39.45 13.37,40.73 13.71,40.73 13.82,40.62 14.31,40.62 14.42,40.73 ; 14.42,40.73 14.65,40.96 14.65,41.44 14.31,41.79 13.82,41.79 13.64,41.61 13.44,41.61 12.29,42.76 12.29,42.83 RN13.4 ; 14.42,40.73 16.11,40.73 16.58,41.2 v1(17.49,41.2)
$1N34140: length 18.4
  Bottom Layer w0.254: 9.89,44.05 10.64,43.3 11.17,43.3 13.27,41.21 13.27,41.2 ; 13.27,41.2 11.69,39.62 11.69,38.1 13.98,35.8 17.12,35.8 19.02,33.91 U48.4 ; 13.27,41.2 v1(14.06,41.2)
$1N34141: length 19
  Bottom Layer w0.254: RN13.2 9.09,44.1 8.52,43.53 8.2,43.53 8.19,43.52 7.97,43.52 7.49,43.04 7.49,42.16 8.44,41.2 v1(10.76,41.2) 10.51,40.95 10.51,38.7 13.81,35.4 16.26,35.4 17.75,33.91 U48.5
$1N34142: length 16.2
  Bottom Layer w0.254: U48.6 16.48,33.91 15.45,34.94 13.7,34.94 ; RN13.1 7.08,43.21 7.08,41.87 7.44,41.51 v1(7.44,41.2) 13.7,34.94
$1N34146: length 19
  Bottom Layer w0.254: 17.76,8.93 18.45,8.24 18.45,8 19.27,7.18 23.39,7.18 24.39,8.18 24.39,8.5 26.87,10.98 v1(27.42,10.98) 29.64,10.98 30.31,11.65 30.31,12.59 29.82,13.08 29.7,13.08 29.26,13.52 28.94,13.52 28.77,13.69 28.77,14.01 RN7.3
$1N34147: length 14.6
  Bottom Layer w0.254: 19.03,8.93 19.72,8.24 19.72,8 20.06,7.66 20.3,7.66 20.37,7.59 23.22,7.59 23.99,8.35 23.99,10.85 v1(24.11,10.98) 24.84,10.98 25.05,11.19 25.05,11.39 25.4,11.73 25.59,11.73 26.37,12.51 26.37,12.92 26.63,13.18 27.67,13.18 27.85,13.36 27.85,14.13 RN7.2
$1N34148: length 10.4
  Bottom Layer w0.254: RN7.1 26.98,13.73 26.83,13.58 26.46,13.58 25.97,13.09 25.97,12.72 25.38,12.13 25.1,12.13 24.53,11.56 23.87,11.56 23.53,11.22 23.53,11.07 23.44,10.98 v1(20.81,10.98) 20.81,9.43 20.3,8.93
$1N34149: length 20.9
  Bottom Layer w0.254: RN7.4 30.72,12.86 v1(30.72,10.98) 29.86,10.13 26.61,10.13 24.8,8.32 24.8,8.01 23.56,6.78 18.41,6.78 17.18,8 17.18,8.24 16.49,8.93
$1N34150: length 23.8
  Bottom Layer w0.254: v1(17.51,10.98) 16.6,10.98 16.12,10.51 14.43,10.51 ; 14.43,10.51 14.32,10.4 13.84,10.4 13.73,10.51 13.38,10.51 12.11,9.23 12.11,8.04 14.16,5.99 18,5.99 20.3,3.69 U52.3 ; 14.43,10.51 14.66,10.74 14.66,11.22 14.32,11.56 13.84,11.56 13.66,11.39 13.46,11.39 12.3,12.54 12.3,12.61 RN17.4
$1N34151: length 18.8
  Bottom Layer w0.254: U52.4 19.03,3.69 17.14,5.58 14,5.58 11.7,7.88 11.7,9.4 13.28,10.98 ; 13.28,10.98 13.28,10.99 11.19,13.08 10.65,13.08 9.91,13.82 RN17.3 ; 13.28,10.98 v1(14.08,10.98)
$1N34152: length 19
  Bottom Layer w0.254: RN17.2 8.91,14.01 8.91,13.69 8.75,13.52 8.43,13.52 8.21,13.3 7.98,13.3 7.5,12.82 7.5,11.94 8.46,10.98 v1(10.78,10.98) 10.52,10.73 10.52,8.48 13.83,5.18 16.28,5.18 17.76,3.69 U52.5
$1N34153: length 16.2
  Bottom Layer w0.254: U52.6 16.49,3.69 15.46,4.72 13.71,4.72 v1(7.45,10.98) 7.45,11.29 7.09,11.65 7.09,12.99 RN17.1
$1N34156: length 15.5
  Bottom Layer w0.254: RN6.2 55.08,24.11 54.88,23.92 54.88,23.72 54.72,23.56 54.52,23.56 54.08,23.11 53.84,23.11 53.68,22.95 53.68,22.41 52.28,21.01 v1(50.54,21.01) 50.54,20.91 51.54,19.91 51.54,17.96 51.02,17.44 50.85,17.44 50.65,17.24 48.2,17.24 47.66,17.78 47.66,18.02 U51.13
$1N34157: length 20.5
  Bottom Layer w0.254: 56.68,24.23 57.79,23.12 57.79,21.65 v1(57.15,21.01) 54.67,21.01 54.09,20.42 53.75,20.42 52.44,19.11 52.44,17.71 51.16,16.43 46.47,16.43 45.12,17.78 45.12,18.02 U51.11
$1N34158: length 24.1
  Bottom Layer w0.254: v1(43.93,21.01) 43.21,20.29 41.41,20.29 ; 41.41,20.29 41.41,20.81 41.21,21 41.21,21.26 40.87,21.6 40.62,21.6 39.87,22.34 39.2,22.34 39.15,22.4 39.15,23.12 38.75,23.52 38.19,23.52 38.19,24.19 RN16.4 ; 41.41,20.29 40.48,20.29 39.23,19.04 39.23,17.64 40.95,15.92 44.4,15.92 45.41,14.9 46.11,14.9 46.52,14.5 47.21,14.5 47.55,14.16 47.55,13.92 U51.3
$1N34159: length 19.8
  Bottom Layer w0.254: RN16.2 36.54,23.92 36.18,23.56 35.63,23.56 34.71,22.64 34.71,21.62 34.9,21.43 36.91,21.43 v1(37.33,21.01) 37.33,18.4 40.62,15.11 44.06,15.11 45.7,13.47 U51.5
$1N34160: length 11.7
  Bottom Layer w0.254: U51.14 48.24,20.01 v1(47.24,21.01) 49.85,21.01 49.96,21.12 49.96,21.25 50.3,21.59 52.2,21.59 53.27,22.66 53.27,23.28 53.51,23.52 53.91,23.52 54.28,23.89 RN6.1
$1N34161: length 18.6
  Bottom Layer w0.254: 53.85,21.14 53.85,21.14 ; RN6.3 55.88,23.92 56.24,23.56 56.78,23.56 57.38,22.95 57.38,22.7 57.28,22.6 57.28,21.92 56.92,21.56 54.4,21.56 v1(53.85,21.01) ; 53.76,21.01 51.95,19.2 51.95,17.79 50.99,16.83 47.34,16.83 45.7,18.47 U51.12
$1N34162: length 20.1
  Bottom Layer w0.254: RN16.3 37.53,24.04 37.53,23.37 37.79,23.11 38.58,23.11 38.74,22.95 38.74,22.17 38.97,21.94 39.7,21.94 v1(40.63,21.01) 38.82,19.21 38.82,17.47 40.78,15.51 44.23,15.51 45.24,14.5 45.94,14.5 46.28,14.16 46.28,13.46 46.51,13.23 U51.4
$1N34163: length 17.7
  Bottom Layer w0.254: RN16.1 34.02,22.52 v1(34.02,21.01) 40.33,14.7 43.2,14.7 43.74,14.16 43.74,13.92 U51.6
$1N34164: length 35.1
  Inner1 w0.2: v1(43.18,28.54) 43.18,28.28 42.29,27.39 31.24,27.39 27.97,30.67 27.97,31.28 27.64,31.6 27.03,31.6 v1(24.77,33.87)
  Inner2 w0.2: v1(13.94,39.15) 18.85,34.23 24.41,34.23 v1(24.77,33.87)
$1N34165: length 29
  Inner1 w0.2: v1(34.29,38.95) 34.42,38.82 v1(41.91,38.82)
  Bottom Layer w0.2: U48.10 15.21,38.95 17.54,36.62 23.7,36.62 25.16,38.08 25.16,38.28 25.83,38.95 v1(34.29,38.95)
$1N34166: length 45.1
  Inner2 w0.2: v1(43.15,38.89) 42.06,37.81 33.4,37.81 27.2,31.6 27.18,31.6 26.86,31.28 26.86,31.26 25.2,29.61 14.79,29.61 14.53,29.35 14.53,28.23 16.77,26 16.77,22.44 13.97,19.65 v1(13.97,18.89)
$1N34167: length 36
  Inner2 w0.2: v1(40.52,18) 41.15,17.36 43.69,17.36 43.95,17.62 43.95,18.89 43.44,19.39 23.37,19.39 23.19,19.57 21.47,19.57 20.85,18.96 v1(15.22,18.96)
  Bottom Layer w0.2: v1(40.52,18) 41.18,18 U51.9
$1N34168: length 34.3
  Inner2 w0.2: v1(43.16,18.71) 23.37,18.71 23.07,18.4 22.61,18.4 22.31,18.71 22.3,18.71 14.73,11.14 14.73,9.74 v1(13.97,8.98)
$1N34169: length 27.6
  Inner2 w0.2: v1(15.22,8.93) 16.31,7.84 41.02,7.84 v1(41.91,8.73)
  Bottom Layer w0.2: 41.89,8.67 41.91,8.69 v1(41.91,8.73)
$1N34170: length 47.4
  Inner2 w0.2: v1(43.16,8.67) 48.73,8.67 49.28,9.23 51.01,9.23 51.57,8.67 65.61,8.67 66.55,9.61 66.55,20.54 68.08,22.06 68.08,28.92 67.06,29.93 v1(67.06,30.32)
  Bottom Layer w0.2: v1(67.06,30.32) 65.9,30.32 U54.9
$1N34172: length 24
  Bottom Layer w0.254: U49.3 47.54,34.11 47.54,34.35 47.2,34.69 46.5,34.69 46.1,35.09 45.4,35.09 44.39,36.11 40.94,36.11 39.22,37.83 39.22,39.23 40.46,40.48 41.4,40.48 ; 41.4,40.48 41.4,40.99 41.2,41.19 41.2,41.44 40.86,41.79 40.61,41.79 39.86,42.53 39.18,42.53 39.13,42.58 39.13,43.31 38.73,43.71 38.17,43.71 38.17,44.37 ; 41.4,40.48 43.2,40.48 v1(43.92,41.2)
$1N34173: length 19.8
  Bottom Layer w0.254: U49.4 46.5,33.42 46.27,33.65 46.27,34.35 45.93,34.69 45.23,34.69 44.22,35.7 40.77,35.7 38.81,37.66 38.81,39.39 v1(40.62,41.2) 39.69,42.13 38.96,42.13 38.73,42.35 38.73,43.14 38.56,43.3 37.78,43.3 37.52,43.56 37.52,44.23
$1N34174: length 19.9
  Bottom Layer w0.254: U49.5 45.69,33.66 44.05,35.29 40.6,35.29 37.31,38.58 v1(37.31,41.2) 36.89,41.62 34.89,41.62 34.7,41.81 34.7,42.83 35.53,43.65 36.27,43.65 36.45,43.83 36.45,44.35 RN14.2
$1N34175: length 17.7
  Bottom Layer w0.254: U49.6 43.73,34.11 43.73,34.35 43.19,34.89 40.32,34.89 v1(34.01,41.2) 34.01,42.71 RN14.1
$1N34176: length 18.7
  Bottom Layer w0.254: U49.12 45.69,38.66 47.32,37.02 50.98,37.02 51.94,37.98 51.94,39.38 53.75,41.2 ; 53.83,41.32 53.84,41.33 ; RN4.3 55.98,44.31 55.98,43.9 56.23,43.65 56.86,43.65 57.37,43.14 57.37,42.89 57.27,42.79 57.27,42.11 56.91,41.75 54.38,41.75 v1(53.83,41.2)
$1N34177: length 15.5
  Bottom Layer w0.254: RN4.2 55.07,43.98 54.65,43.56 54.32,43.56 54.07,43.3 53.83,43.3 53.66,43.14 53.66,42.59 52.27,41.2 v1(50.53,41.2) 50.53,41.09 51.53,40.09 51.53,38.15 51.01,37.63 50.84,37.63 50.64,37.43 48.19,37.43 47.65,37.97 47.65,38.2 U49.13
$1N34178: length 11.4
  Bottom Layer w0.254: U49.14 48.23,40.19 v1(47.23,41.2) 49.84,41.2 49.95,41.31 49.95,41.44 50.29,41.78 52.19,41.78 53.26,42.85 53.26,43.47 53.49,43.71 53.89,43.71 54.27,44.08
$1N34179: length 20.5
  Bottom Layer w0.254: U49.11 45.11,38.2 45.11,37.97 46.46,36.62 51.14,36.62 52.43,37.9 52.43,39.3 53.74,40.61 54.08,40.61 54.66,41.2 v1(57.14,41.2) 57.78,41.83 57.78,43.31 56.67,44.42
$1N34186: length 28.1
  Inner2 w0.2: v1(59.68,18.9) 58.8,19.78 58.8,24.22 59.57,24.98 59.57,25.08 59.52,25.13 59.52,25.59 59.57,25.64 59.57,25.87 60.07,26.38 62.61,26.38 64.77,28.54 66.68,28.54 67.06,28.16 67.06,27.01 v1(66.68,26.63)
  Bottom Layer w0.2: v1(66.68,26.63) 65.77,26.63 U54.12 ; v1(60.45,10.98) 60.45,13.55 59.03,14.98 59.03,18.46 59.06,18.49 59.06,18.63 59.2,18.77 59.55,18.77 v1(59.68,18.9)
$1N34187: length 12.8
  Inner2 w0.2: v1(63.76,21.01) 62.59,21.01 v1(59.68,18.1)
  Bottom Layer w0.2: U54.13 66.14,25.4 67.06,24.47 67.06,23.98 66.65,23.57 64.9,23.57 63.76,22.43 v1(63.76,21.01)
$1N34188: length 25.2
  Top Layer w0.2: SW145.2 62.32,12.41 60.07,12.41 v1(59.57,12.92)
  Inner2 w0.2: v1(65.66,27.9) 62.56,24.81 60.13,24.81 59.18,23.86 59.18,20.2 v1(59.68,19.7)
  Bottom Layer w0.2: v1(59.57,12.92) 59.57,13.94 58.68,14.83 58.68,18.91 59.18,19.41 59.38,19.41 v1(59.68,19.7)
$1N34206: length 19
  Bottom Layer w0.254: U57.12 18.45,28.3 18.45,28.07 19.27,27.25 23.39,27.25 24.39,28.25 24.39,28.57 26.87,31.05 v1(27.41,31.05) 29.64,31.05 30.31,31.72 30.31,32.65 29.81,33.15 29.7,33.15 29.25,33.59 28.93,33.59 28.77,33.75 28.77,34.07 RN21.3
$1N34207: length 14.6
  Bottom Layer w0.254: RN21.2 27.85,34.2 27.85,33.42 27.67,33.24 26.63,33.24 26.37,32.98 26.37,32.58 25.58,31.79 25.39,31.79 25.05,31.45 25.05,31.26 24.84,31.05 v1(24.11,31.05) 23.98,30.92 23.98,28.42 23.22,27.65 20.37,27.65 20.3,27.73 20.06,27.73 19.72,28.07 19.72,28.3 U57.13
$1N34208: length 10.4
  Bottom Layer w0.254: U57.14 20.81,29.5 v1(20.81,31.05) 23.44,31.05 23.53,31.13 23.53,31.29 23.87,31.63 24.53,31.63 25.1,32.2 25.38,32.2 25.96,32.78 25.96,33.15 26.46,33.65 26.83,33.65 26.97,33.79 RN21.1
$1N34209: length 20.9
  Bottom Layer w0.254: U57.11 17.18,28.3 17.18,28.07 18.41,26.84 23.56,26.84 24.8,28.08 24.8,28.38 26.61,30.19 29.86,30.19 v1(30.71,31.05) 30.71,32.93 RN21.4
$1N34210: length 23.8
  Bottom Layer w0.254: 14.43,30.57 14.32,30.46 13.84,30.46 13.72,30.57 13.38,30.57 12.11,29.3 12.11,28.11 14.16,26.05 18,26.05 20.3,23.76 U57.3 ; 14.43,30.57 14.66,30.81 14.66,31.29 14.32,31.63 13.84,31.63 13.66,31.45 13.46,31.45 12.3,32.61 12.3,32.67 RN20.4 ; 14.43,30.57 16.12,30.57 16.59,31.05 v1(17.51,31.05)
$1N34211: length 18.8
  Bottom Layer w0.254: 13.28,31.05 13.28,31.06 11.19,33.15 10.65,33.15 9.91,33.89 RN20.3 ; 13.28,31.05 v1(14.08,31.05) ; 13.28,31.05 11.7,29.47 11.7,27.94 13.99,25.65 17.14,25.65 19.03,23.76 U57.4
$1N34212: length 19
  Bottom Layer w0.254: U57.5 17.76,23.76 16.27,25.24 13.83,25.24 10.52,28.55 10.52,30.79 v1(10.78,31.05) 8.46,31.05 7.5,32 7.5,32.89 7.98,33.37 8.21,33.37 8.43,33.59 8.75,33.59 8.91,33.75 8.91,34.07 RN20.2
$1N34213: length 16.2
  Bottom Layer w0.254: 13.71,24.79 15.46,24.79 16.49,23.76 U57.6 ; RN20.1 7.09,33.06 7.09,31.72 7.45,31.36 v1(7.45,31.04) 13.71,24.78
$1N34214: length 27.3
  Inner2 w0.2: v1(41.79,28.66) 41.53,28.66 41.02,28.16 16.06,28.16 v1(15.22,28.99)
  Bottom Layer w0.2: v1(41.79,28.66) 41.82,28.66 U58.9
$1N34216: length 24.1
  Bottom Layer w0.254: U58.3 47.55,23.96 47.55,24.19 47.21,24.53 46.52,24.53 46.11,24.94 45.41,24.94 44.4,25.95 40.95,25.95 39.23,27.67 39.23,29.07 40.48,30.32 41.41,30.32 ; 41.41,30.32 41.41,30.84 41.21,31.04 41.21,31.29 40.87,31.63 40.62,31.63 39.87,32.38 39.2,32.38 39.15,32.43 39.15,33.15 38.75,33.55 38.19,33.55 38.19,34.22 RN22.4 ; 41.41,30.32 43.21,30.32 v1(43.93,31.04)
$1N34217: length 20.1
  Bottom Layer w0.254: RN22.3 37.53,34.07 37.53,33.41 37.79,33.15 38.58,33.15 38.74,32.98 38.74,32.2 38.97,31.97 39.7,31.97 v1(40.63,31.05) 38.82,29.24 38.82,27.51 40.78,25.54 44.23,25.54 45.24,24.53 45.94,24.53 46.28,24.19 46.28,23.5 46.51,23.27 U58.4
$1N34218: length 19.8
  Bottom Layer w0.254: RN22.2 36.54,33.95 36.18,33.59 35.63,33.59 34.71,32.67 34.71,31.65 34.9,31.46 36.91,31.46 v1(37.33,31.05) 37.33,28.43 40.62,25.14 44.06,25.14 45.7,23.5 U58.5
$1N34219: length 17.7
  Bottom Layer w0.254: RN22.1 34.02,32.55 v1(34.02,31.04) 40.33,24.73 43.2,24.73 43.74,24.19 43.74,23.96 U58.6
$1N34220: length 18.6
  Bottom Layer w0.254: v1(53.85,31.04) 54.4,31.59 56.92,31.59 57.28,31.95 57.28,32.63 57.38,32.73 57.38,32.99 56.78,33.59 56.24,33.59 55.88,33.95 RN23.3 ; 53.76,31.04 51.95,29.23 51.95,27.83 50.99,26.87 47.34,26.87 45.7,28.5 U58.12 ; 53.85,31.17 53.85,31.17
$1N34221: length 15.5
  Bottom Layer w0.254: U58.13 47.66,28.05 47.66,27.81 48.2,27.27 50.65,27.27 50.85,27.47 51.02,27.47 51.54,28 51.54,29.94 50.54,30.94 v1(50.54,31.04) 52.28,31.04 53.68,32.44 53.68,32.98 53.84,33.15 54.08,33.15 54.52,33.59 54.72,33.59 54.88,33.75 54.88,33.95 55.08,34.14 RN23.2
$1N34222: length 11.7
  Bottom Layer w0.254: RN23.1 54.28,33.93 53.91,33.55 53.51,33.55 53.27,33.32 53.27,32.7 52.2,31.63 50.3,31.63 49.96,31.28 49.96,31.15 49.85,31.04 v1(47.24,31.04) 48.24,30.04 U58.14
$1N34223: length 20.5
  Bottom Layer w0.254: U58.11 45.12,28.05 45.12,27.81 46.47,26.46 51.16,26.46 52.44,27.74 52.44,29.14 53.75,30.46 54.09,30.46 54.67,31.04 v1(57.15,31.04) 57.79,31.68 57.79,33.16 56.68,34.27

## Copper pours and planes (outline as drawn; the poured copper is in the pictures)
GND on Top Layer: -3.3,52.67 72.01,52.67 72.01,-2.83 -3.3,-2.83
GND on Bottom Layer: -2.03,52.41 71.89,52.41 71.89,-3.47 -2.03,-3.47
GND on Inner1: -3.05,53.68 72.01,53.68 72.01,-4.48 -3.05,-4.48
GND on Inner2: -2.66,52.67 74.04,52.67 74.04,-5.25 -2.66,-5.25

Small or netless copper shapes (teardrops, artwork), in the pictures only: 217 on Top Layer, 319 on Bottom Layer, 37 on Inner1, 23 on Inner2

## Text on the board
Top Silkscreen Layer: 3V3 | GND | PL | CLK | SDA | DATA | CAPS | SHIFT | TAB | ENTER | SPACE | BACK | CTRL | ` | DELETE | ESC | ALT | ~ | Q | A | Z | 1 | W | S | X | 2 | E | D | C | 3 | R | F | V | 4 | T | G | B | 5 | Y | H | N | 6 | U | J | M | 7 | K | , | 8 | I | O | L | . | 9 | P | ; | < | 0 | > | - | [ | : | / | _ | ] | { | ? | + | ! | = | } | * | | | \ | KeyBoard | ← | ↑ | ↓ | →
